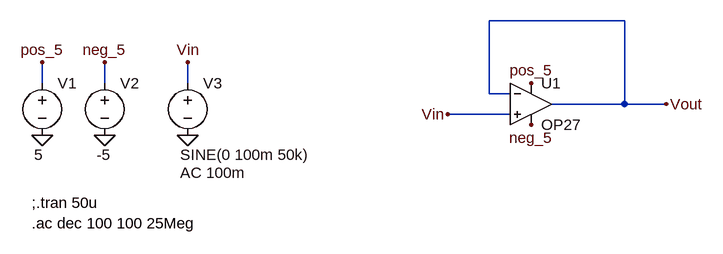
[diagram p0: schematic 1a.asc]
1a.asc, the LTspice schematic file:
Version 4
SHEET 1 1620 680
WIRE 208 0 0 0
WIRE -688 96 -688 64
WIRE -592 96 -592 64
WIRE -464 96 -464 64
WIRE 0 112 0 0
WIRE 32 112 0 112
WIRE 208 128 208 0
WIRE 208 128 96 128
WIRE 272 128 208 128
WIRE 32 144 -64 144
FLAG -688 64 pos_5
FLAG -592 176 0
FLAG -592 64 neg_5
FLAG -688 176 0
FLAG -464 176 0
FLAG -464 64 Vin
FLAG 64 96 pos_5
FLAG 64 160 neg_5
FLAG -64 144 Vin
FLAG 272 128 Vout
SYMBOL voltage -592 80 R0
WINDOW 123 0 0 Left 0
WINDOW 39 0 0 Left 0
WINDOW 3 -12 126 Left 2
SYMATTR Value -5
SYMATTR InstName V2
SYMBOL OpAmps\\OP27 64 64 R0
SYMATTR InstName U1
SYMBOL voltage -688 80 R0
WINDOW 123 0 0 Left 0
WINDOW 39 0 0 Left 0
WINDOW 3 -12 126 Left 2
SYMATTR Value 5
SYMATTR InstName V1
SYMBOL voltage -464 80 R0
WINDOW 123 -12 154 Left 2
WINDOW 39 0 0 Left 0
WINDOW 3 -12 126 Left 2
SYMATTR Value2 AC 100m
SYMATTR Value SINE(0 100m 50k)
SYMATTR InstName V3
TEXT -704 280 Left 2 !;.tran 50u\n.ac dec 100 100 25Meg

The netlist it stands for:
* 1a.asc
V2 neg_5 0 -5
XU1 Vin Vout pos_5 neg_5 Vout OP27  ; pins In+ In- V+ V- OUT
V1 pos_5 0 5
V3 Vin 0 SINE(0 100m 50k) AC 100m
;.tran 50u
.ac dec 100 100 25Meg
.lib ADI.lib
.backanno
.end

* Results of the author's LTspice run, read from the files saved beside the schematic
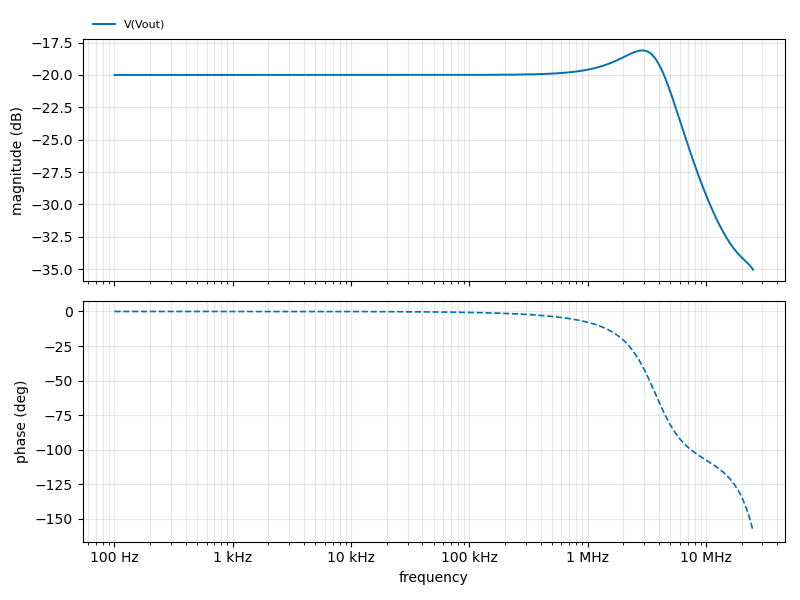
[diagram p1: AC Analysis of 1a.asc, plotted from the saved traces]
* AC Analysis, 1 run:
*   V(Vout): -20.00 dB at 100 Hz, -35.04 dB at 25 MHz, peak -18.11 dB at 2.884 MHz, 3 dB below the peak at 4.913 MHz